# EAGLE schematic table_light_shield (EAGLE 6.6.0)
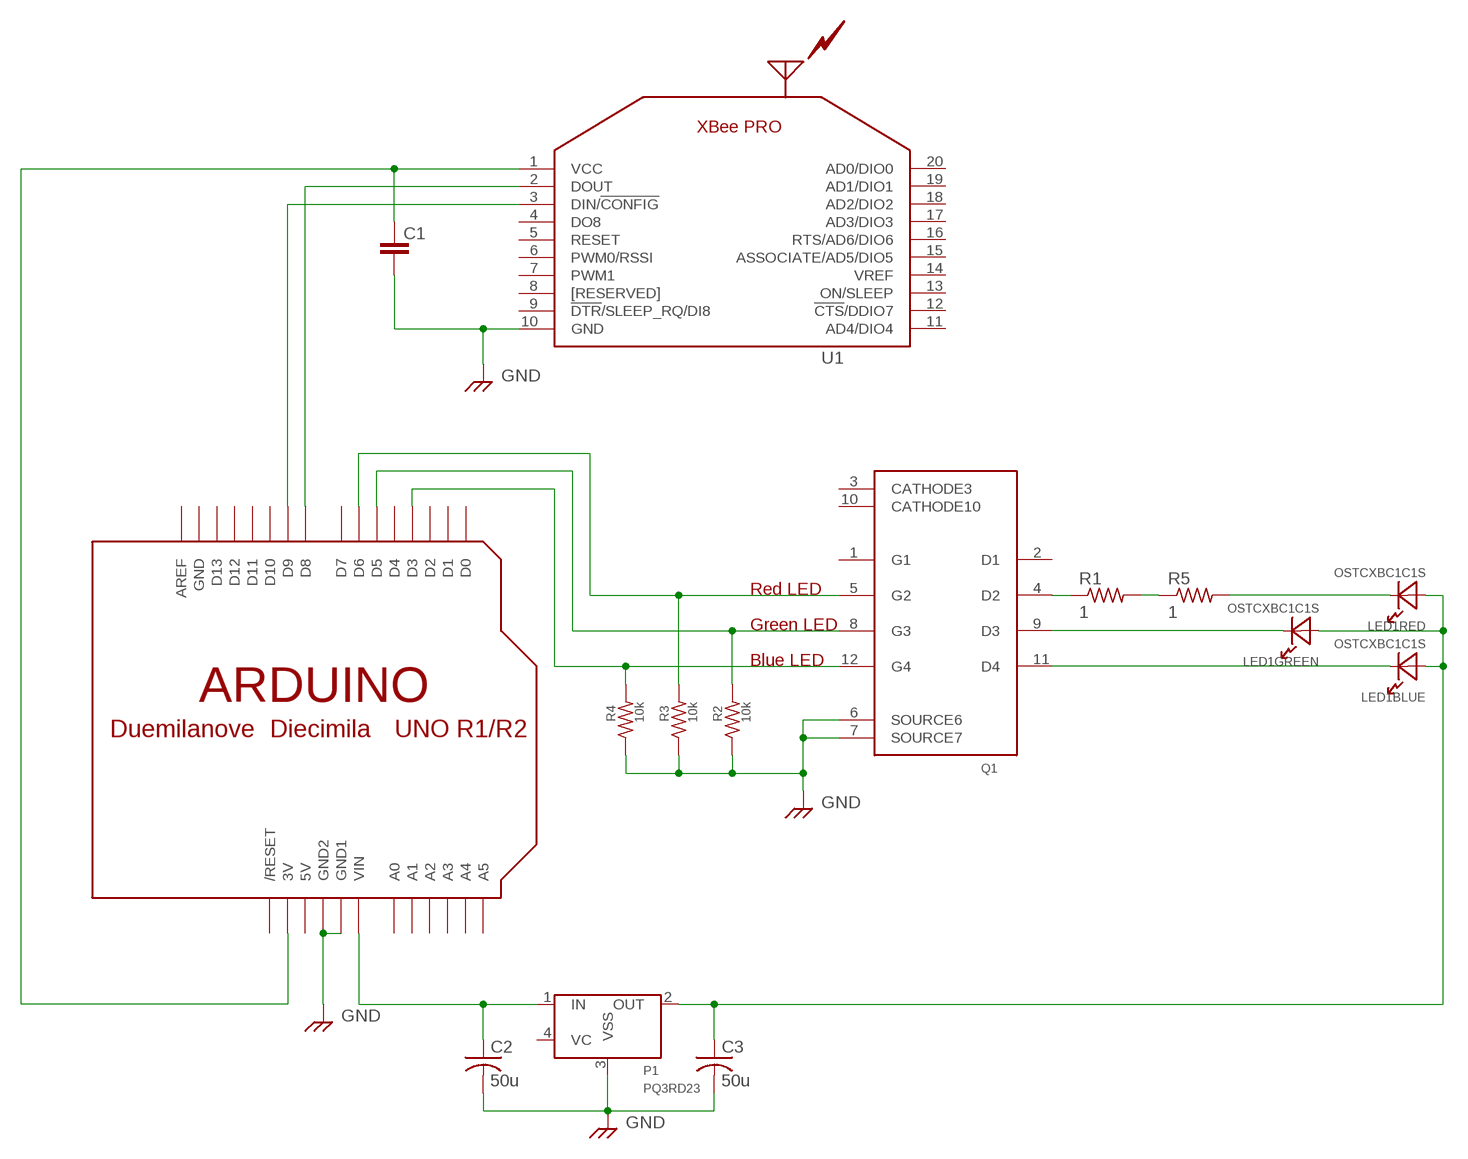
[diagram p0: schematic, sheet 1]

## Parts
C1  GRM18  [1608(1.6*0.8MM)]
C2  50u  C-US025-050X050  [C025-050X050]
C3  50u  C-US025-050X050  [C025-050X050]
LED1  OSTCXBC1C1S  [OSTCXBC1C1S_WITH_HEATSINK]
P1  PQ3RD23  [PQ3RD23]
Q1  MP4401  [MP4401]
R1  1  FLIPFLOP-RES  [0805-THM]
R2  10k  CHIP1608  [1608(1.6*0.8MM)]
R3  10k  CHIP1608  [1608(1.6*0.8MM)]
R4  10k  CHIP1608  [1608(1.6*0.8MM)]
R5  1  FLIPFLOP-RES  [0805-THM]
U1  XBEE_PROXPPN101BFCN  [XBEE_ON_XPPN101BFCN-RC]
U$1  ARDUINO-NOHOLE  [ARDUINO-NOHOLE]

## Nets
GND: C1.P$2 C2.2 C3.2 P1.3(VSS) Q1.6(SOURCE6) Q1.7(SOURCE7) R2.P$3 R3.P$3 R4.P$3 U1.10(GND) U$1.GND1 U$1.GND2
N$1: C2.1 P1.1(IN) U$1.VIN
N$2: Q1.4(D2) R1.1
N$3: Q1.5(G2) R3.P$4 U$1.D6
N$4: Q1.8(G3) R2.P$4 U$1.D5
N$5: Q1.12(G4) R4.P$4 U$1.D3
N$6: C1.P$1 U1.1(VCC) U$1.3V
N$7: U1.2(DOUT) U$1.D8
N$8: U1.3(DIN/!CONFIG) U$1.D9
N$9: LED1.B-(BLUE:C) Q1.11(D4)
N$10: LED1.R-(RED:C) R5.2
N$11: R1.2 R5.1
N$13: C3.1 LED1.B+(BLUE:A) LED1.G+(GREEN:A) LED1.R+(RED:A) P1.2(OUT)
N$14: LED1.G-(GREEN:C) Q1.9(D3)
Unconnected: P1.4(VC) Q1.1(G1) Q1.2(D1) Q1.3(CATHODE3) Q1.10(CATHODE10) U1.4(DO8) U1.5(RESET) U1.6(PWM0/RSSI) U1.7(PWM1) U1.8([RESERVED]) U1.9(!DTR!/SLEEP_RQ/DI8) U1.11(AD4/DIO4) U1.12(!CTS!/DDIO7) U1.13(ON/SLEEP) U1.14(VREF) U1.15(ASSOCIATE/AD5/DIO5) U1.16(RTS/AD6/DIO6) U1.17(AD3/DIO3) U1.18(AD2/DIO2) U1.19(AD1/DIO1) U1.20(AD0/DIO0) U$1.A0 U$1.A1 U$1.A2 U$1.A3 U$1.A4 U$1.A5 U$1.AREF U$1.D0 U$1.D1 U$1.D2 U$1.D4 U$1.D7 U$1.D10 U$1.D11 U$1.D12 U$1.D13 U$1.RESET(/RESET)

## Notes on the sheet
- Red LED
- Green LED
- Blue LED

## Power pins joined to a net without a drawn wire
5V: U$1.5V
GND: U$1.GND

## Library data of the parts
C1 = Capasitor:GRM: GRM series chip capasitor producted by muRata.Co
C2 C3 = rcl:C-US: CAPACITOR, American symbol
LED1 = LED:OSTCXBC1C1S
P1 = Voltage Regulator:PQ3RD23: PQ3RD23 is a kind of voltage regulator with power control pin by SHARP. Output ON: control pin is High or Open (photo is from Akituki) ------------------------------------------------------------------- Datasheet: here <http://www.sharp.co.jp/products/device/lineup/data/pdf/datasheet/pq05rd21_j.pdf> Shop: 秋月電子通商 <http://akizukidenshi.com/catalog/g/gI-01177/>
Q1 = FET n-ch:MP4401
R1 R5 = adafruit:FLIPFLOP-RES: Flip Flop resistor An 0805 resistor inside a standard 1/4W 5% resistor. Makes for easy mods
R2-R4 = Resistor:CHIP: 1608(1.6*0.8) size chip resistor
U1 = ZigBee Modules:XBEE_PRO: XBee , ZigBee transceiver Producted by XBee ; Digi-Key.Co
U$1 = adafruit:ARDUINO: Arduino Diecimila/Duemilanove Make a shield with ease, this package has all the named pins as well as the two mounting drill holes and an outline of the USB and DC power connector. The outline is on the DIMENSION layer, so if your board house uses it they will cut the outline to match. http://www.ladyada.net/library/pcb/eaglelibrary.html